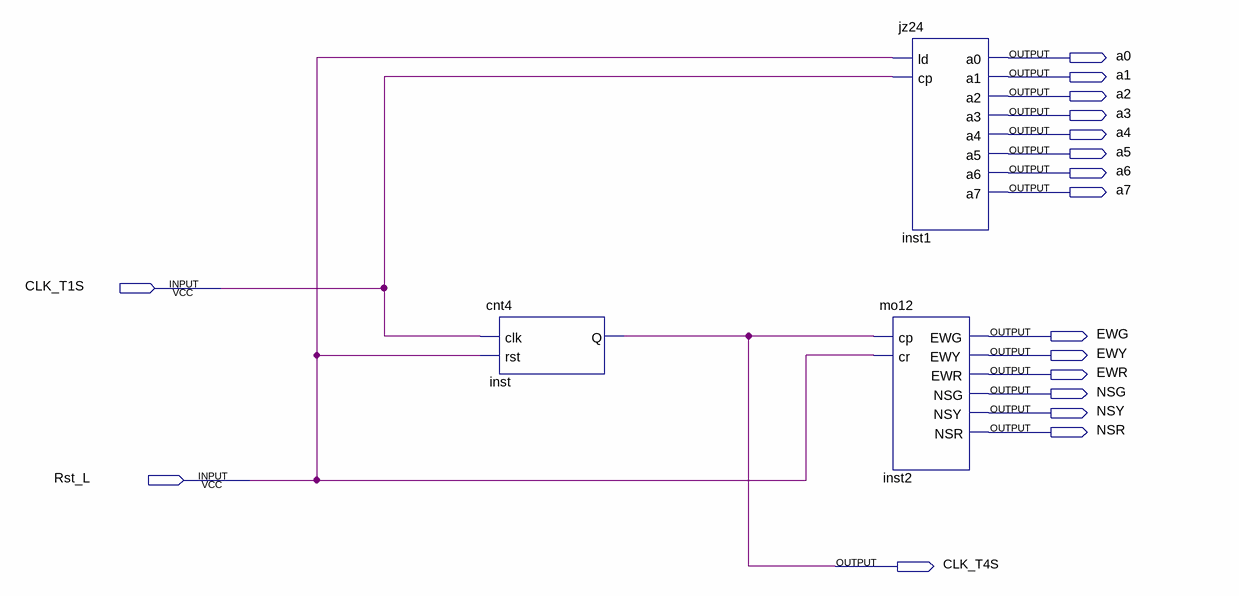
[diagram p0: schematic sheet]
// Quartus schematic simu.bdf as structural Verilog: 3 symbols, 17 pins
module simu (
  input  CLK_T1S,
  input  Rst_L,
  output a0,
  output a1,
  output a2,
  output a3,
  output a4,
  output a5,
  output a6,
  output a7,
  output EWG,
  output EWY,
  output EWR,
  output NSG,
  output NSY,
  output NSR,
  output CLK_T4S
);

  cnt4 inst (.clk(CLK_T1S), .rst(Rst_L), .Q(CLK_T4S));
  jz24 inst1 (.ld(Rst_L), .cp(CLK_T1S), .a0(a0), .a1(a1), .a2(a2), .a3(a3), .a4(a4), .a5(a5), .a6(a6), .a7(a7));
  mo12 inst2 (.cp(CLK_T4S), .cr(Rst_L), .EWG(EWG), .EWY(EWY), .EWR(EWR), .NSG(NSG), .NSY(NSY), .NSR(NSR));
endmodule
